# Altium schematic sheet Schema_Soldeerbout1.SchDoc
size A4; SheetNumber: 1; SheetTotal: 6
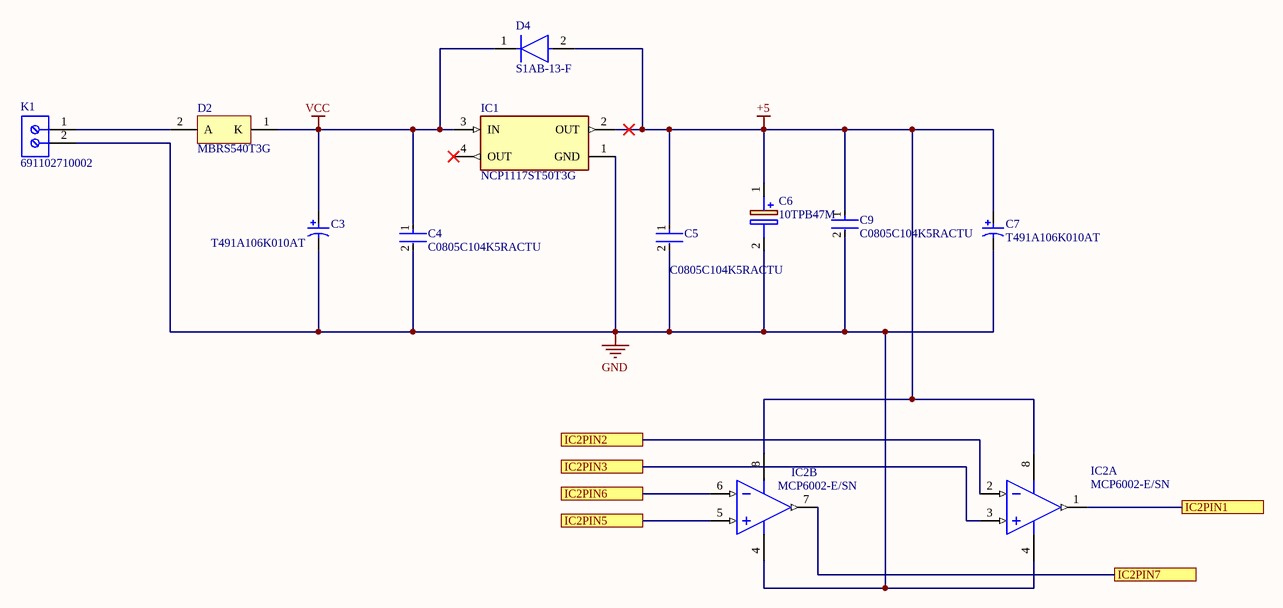
[diagram p0: Schema_Soldeerbout1.SchDoc]

## Parts
C3  T491A106K010AT  [KEMT-A-3216-18-2_M]
C4  C0805C104K5RACTU  [FP-C0805C-DN-MFG]
C5  C0805C104K5RACTU  [FP-C0805C-DN-MFG]
C6  10TPB47M  [CAPPM3528X210N]
C7  T491A106K010AT  [KEMT-A-3216-18-2_M]
C9  C0805C104K5RACTU  [FP-C0805C-DN-MFG]
D2  MBRS540T3G  [ONSC-SMC-2-403-03_V]
D4  S1AB-13-F  [FP-SMB-MFG]
IC1  NCP1117ST50T3G  [FP-318H-MFG]
IC2  MCP6002-E/SN  [SOIC-SN8_M]  (parts A,B of 2)
K1  691102710002  [691102710002]

## Ports
IC2PIN1, IC2PIN2, IC2PIN3, IC2PIN5, IC2PIN6, IC2PIN7

## Nets
+5: C5.1 C6.1(+) C7.1 C9.1 D4.2(A) IC1.2(OUT) IC2.8(VDD)
GND: C3.2 C4.2 C5.2 C6.2(-) C7.2 C9.2 IC1.1(GND) IC2.4(VSS) K1.2
VCC: C3.1 C4.1 D2.1(K) D4.1(C) IC1.3(IN)
IC2PIN1: IC2.1(VOUTA) ; port IC2PIN1
IC2PIN2: IC2.2(VINA-) ; port IC2PIN2
IC2PIN3: IC2.3(VINA+) ; port IC2PIN3
IC2PIN5: IC2.5(VINB+) ; port IC2PIN5
IC2PIN6: IC2.6(VINB-) ; port IC2PIN6
IC2PIN7: IC2.7(VOUTB) ; port IC2PIN7
NetD2_2: D2.2(A) K1.1

Not connected (* = marked no-connect by the designer): IC1 4(OUT)*

## Library data of the parts
C3 C7 = CMP-2000-05172-1: Capacitor, Tantalum, 10 uF, +/- 10%, 10 V, -55 to 125 degC, 2-Pin SMD (1206), RoHS, Tape and Reel; Manufacturer Size Code: A; Manufacturer: Kemet; Type: Molded; Online Catalog: T491Series; Other Names: 399-3684-2; Voltage - Rated: 10V; Lifetime @ Temp.: 2000Hrs@85degC; Product Training Modules: CapacitorBasics-TypicalUsesforCapacitorsDeratingGuidelinesforSurfaceMountTantalumCapacitors; ESR (Equivalent Series Resistance): 3.8Ohm; Capacitance: 10µF; Catalog Drawings: T49x,T5xxSeries_A-side1T49x,T5xxSeries_A,B-side2T49x,T5xxSeries_A,SBottom; Family: TantalumCapacitors; Manufacturer URL: http://www.kemet.com/; Datasheet URL: http://www.farnell.com/datasheets/1824869.pdf; Package Reference: 1206; Packaging: Tape&Reel(TR); Series: T491; Operating Temperature: -55degC~125degC; Mounting Type: SurfaceMount; Height - Seated (Max): 0.071"(1.80mm); Package / Case: 1206(3216Metric); Package Description: 2-Pin Surface Mount Device, Body 3.2 x 1.6 mm; Features: GeneralPurpose; Tolerance: ±10%; Lead Spacing: -; Size / Dimension: 0.126"Lx0.063"W(3.20mmx1.60mm); Standard Package: 2,000; Datasheet Version: Apr-14; Category: Capacitors
C4 C5 C9 = CMP-2007-00279-2: CAP CER 0.1UF 50V X7R 0805; Manufacturer: KEMET; Value: 0.10 μF; Tolerance: 0.1; Temperature Coefficient: 30ppm/°C; Material: Ceramic; Manufacturer Part Number: C0805C104K5RACTU; Device Class L2: Capacitors; Temperature Range Low: -55°C; Voltage Rating: 50 V; Digikey Description: CAP CER 0.1UF 50V X7R 0805; Category: Cap; ComponentLink2Description: Datasheet; Octopart: https://octopart.com/c0805c104k5ractu-kemet-143926; RoHS: TRUE; ComponentLink2URL: https://content.kemet.com/datasheets/KEM_C1003_C0G_SMD.pdf; Temperature Characteristic: X7R; Temperature: -55°C to +125°C; Height: 0.88mm; Temperature Range High: +125°C; Device Class L1: Passive Components; Automotive: No; Lead Free: Yes; Ipc Land Pattern Name: CAPC200125X78; Device Class L3: Ceramic Capacitors; Mouser Description: Cap Ceramic 0.1uF 50V X7R 10% SMD 2.0 x 1.2 mm 125 C Paper T/R; Capacitance: 0.10 μF; Package: C0805C-DN
C6 = 10TPB47M: Capacitor Polarised; Manufacturer_Name: Panasonic; Datasheet Link: https://www.mouser.com/datasheet/2/315/AAA8000C65-1150039.pdf; Height: 2.1mm; Manufacturer_Part_Number: 10TPB47M; Mouser Part Number: 667-10TPB47M; Mouser Price/Stock: https://www.mouser.co.uk/ProductDetail/Panasonic/10TPB47M/?qs=OE1iw1LrrPF6e38T0%252BNoyw%3D%3D; Arrow Part Number: 10TPB47M; Arrow Price/Stock: https://www.arrow.com/en/products/10tpb47m/panasonic
D2 = CMP-1055-00390-1: Schottky Power Rectifier, 2-Pin SMC, Pb-Free, Tape and Reel; Manufacturer: On Semiconductor; Configuration: Single; IFSM Max (A): 190; ComponentLink1URL: http://www.onsemi.com/; ComponentLink3URL: http://www.onsemi.com/pub_link/Collateral/403-03.PDF; ComponentLink1Description: Manufacturer URL; PackageVersion: Rev. E, 08/2005; Packing: Tape and Reel; ComponentLink2URL: http://www.onsemi.cn/pub_link/Collateral/MBRS540T3-D.PDF; RoHS: TRUE; DatasheetVersion: Rev. 8; Mounting Technology: Surface Mount; ComponentLink3Description: Package Specification; ComponentLink2Description: Datasheet; PartNumber: MBRS540T3G; PackageDescription: 2-Pin Small Molded Package, J-Bend Lead, Body 5.845 x 6.855 mm; PackageReference: SMC-2-403-03
D4 = CMP-0586-00001-3: DIODE GEN PURP 50V 1A SMB; Element Configuration: Single; Max Surge Current: 30A; Polarity: Standard; Recovery Time: 1.8us; Forward Voltage: 1.1V; Capacitance: 10pF; Peak Reverse Current: 5uA; Voltage Rating (DC): 50V; Weight: 0.00328oz; Average Rectified Current: 1A; Output Current: 1A; Number of Pins: 2; Lead Free: Lead Free; Packaging: Tape and Reel; Height: 2.42mm; Current Rating: 1A; Forward Current: 1A; Peak Non-Repetitive Surge Current: 30A; Reverse Voltage (DC): 50V; Max Reverse Voltage (DC): 50V; Reverse Recovery Time: 1.8us; Width: 3.94mm; Radiation Hardening: No; Case/Package: SMB; Min Operating Temperature: -65°C; Termination: SMD/SMT; Max Operating Temperature: 150°C; Package Quantity: 3000; Length: 4.57mm; Max Repetitive Reverse Voltage (Vrrm): 50V
IC1 = CMP-0592-00001-3: IC REG LINEAR 5V 1A SOT223; Output Type: Fixed; Quiescent Current: 10mA; Number of Outputs: 1; Polarity: Positive; Min Input Voltage: 3.5V; Input Bias Current: 6mA; Dropout Voltage: 1.2V; Power Rating: 781mW; Accuracy: 1%; Max Input Voltage: 20V; Max Output Current: 1A; Output Current: 1A; Packaging: Tape and Reel; Contact Plating: Tin; Package Quantity: 1; Halogen Free: Halogen Free; Case/Package: SOT-223; Radiation Hardening: No; Min Operating Temperature: 0°C; Min Current Limit: 1A; Max Operating Temperature: 125°C; Number of Regulators: 1; Number of Pins: 4; Width: 3.7mm; Lead Free: Lead Free; Output Voltage Accuracy: 1%; REACH SVHC: No SVHC; Length: 6.7mm; Output Voltage: 5V; Tolerance: 1%; Height: 1.69mm; Nominal Output Voltage: 5V
IC2 = CMP-0187-00368-2: 1 MHz, Low-Power Operational Amplifier, 8-Pin SOIC, Extended Temperature; ComponentLink1URL: http://www.microchip.com/; ComponentLink2URL: http://ww1.microchip.com/downloads/en/DeviceDoc/21733j.pdf; ComponentLink3URL: http://www.microchip.com/stellent/groups/techpub_sg/documents/packagingspec/en012702.pdf; Code_JEDEC: MS-012; PackageVersion: revBB, Aug-2009; ComponentLink2Description: Datasheet; PackageDescription: 8-Lead Plastic Small Outline (SN) - Narrow, 3.90mm Body [SOIC]; PackageReference: SOIC-SN8; ComponentLink1Description: Manufacturer URL; RevisionNote: URLs added.; Code_IPC: SOIC127P600-8; ComponentLink3Description: Package Specification; DatasheetVersion: revJ, Nov-2009
K1 = CMP-1502-03258-1: Series 102 - 5.00 mm Horizontal Entry Modular with Pressure Clamp WR-TBL, 2 pin; Manufacturer: Wurth Elektronik; Pin Number: 2; Pitch: 5.00mm; Manufacturer URL: http://www.we-online.de; Mounting Technology: THT; Publisher: WurthElektronik; Packaging: Box; Package Reference: 691102710002; Datasheet URL: http://katalog.we-online.de/em/datasheet/6911027100xx.pdf; Operating Temperature: -40to105degC; Part Number: 691102710002